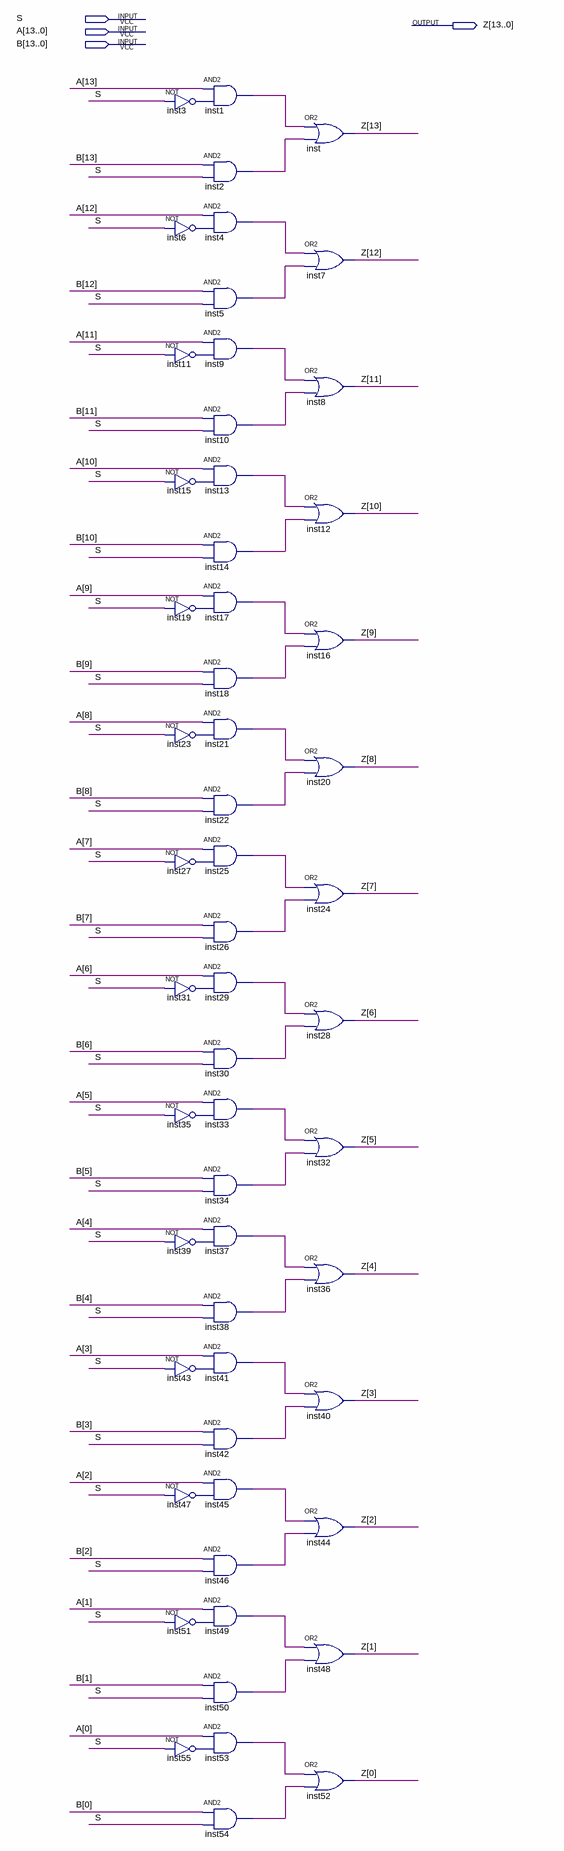
[diagram p0: schematic sheet]
// Quartus schematic g48_busmux.bdf as structural Verilog: 56 symbols, 4 pins
module g48_busmux (
  input  S,
  input  [13:0] A,
  input  [13:0] B,
  output [13:0] Z
);

  wire inst1_out, inst2_out, inst3_out, inst4_out, inst5_out, inst6_out, inst9_out, inst10_out, inst11_out,
       inst13_out, inst14_out, inst15_out, inst17_out, inst18_out, inst19_out, inst21_out, inst22_out,
       inst23_out, inst25_out, inst26_out, inst27_out, inst29_out, inst30_out, inst31_out, inst33_out,
       inst34_out, inst35_out, inst37_out, inst38_out, inst39_out, inst41_out, inst42_out, inst43_out,
       inst45_out, inst46_out, inst47_out, inst49_out, inst50_out, inst51_out, inst53_out, inst54_out,
       inst55_out;

  not inst3 (inst3_out, S);
  not inst6 (inst6_out, S);
  not inst11 (inst11_out, S);
  not inst15 (inst15_out, S);
  not inst19 (inst19_out, S);
  not inst23 (inst23_out, S);
  not inst27 (inst27_out, S);
  not inst31 (inst31_out, S);
  not inst35 (inst35_out, S);
  not inst39 (inst39_out, S);
  not inst43 (inst43_out, S);
  not inst47 (inst47_out, S);
  not inst51 (inst51_out, S);
  not inst55 (inst55_out, S);
  and inst1 (inst1_out, A[13], inst3_out);
  and inst2 (inst2_out, B[13], S);
  and inst4 (inst4_out, A[12], inst6_out);
  and inst5 (inst5_out, B[12], S);
  and inst9 (inst9_out, A[11], inst11_out);
  and inst10 (inst10_out, B[11], S);
  and inst13 (inst13_out, A[10], inst15_out);
  and inst14 (inst14_out, B[10], S);
  and inst17 (inst17_out, A[9], inst19_out);
  and inst18 (inst18_out, B[9], S);
  and inst21 (inst21_out, A[8], inst23_out);
  and inst22 (inst22_out, B[8], S);
  and inst25 (inst25_out, A[7], inst27_out);
  and inst26 (inst26_out, B[7], S);
  and inst29 (inst29_out, A[6], inst31_out);
  and inst30 (inst30_out, B[6], S);
  and inst33 (inst33_out, A[5], inst35_out);
  and inst34 (inst34_out, B[5], S);
  and inst37 (inst37_out, A[4], inst39_out);
  and inst38 (inst38_out, B[4], S);
  and inst41 (inst41_out, A[3], inst43_out);
  and inst42 (inst42_out, B[3], S);
  and inst45 (inst45_out, A[2], inst47_out);
  and inst46 (inst46_out, B[2], S);
  and inst49 (inst49_out, A[1], inst51_out);
  and inst50 (inst50_out, B[1], S);
  and inst53 (inst53_out, A[0], inst55_out);
  and inst54 (inst54_out, B[0], S);
  or inst (Z[13], inst1_out, inst2_out);
  or inst7 (Z[12], inst4_out, inst5_out);
  or inst8 (Z[11], inst9_out, inst10_out);
  or inst12 (Z[10], inst13_out, inst14_out);
  or inst16 (Z[9], inst17_out, inst18_out);
  or inst20 (Z[8], inst21_out, inst22_out);
  or inst24 (Z[7], inst25_out, inst26_out);
  or inst28 (Z[6], inst29_out, inst30_out);
  or inst32 (Z[5], inst33_out, inst34_out);
  or inst36 (Z[4], inst37_out, inst38_out);
  or inst40 (Z[3], inst41_out, inst42_out);
  or inst44 (Z[2], inst45_out, inst46_out);
  or inst48 (Z[1], inst49_out, inst50_out);
  or inst52 (Z[0], inst53_out, inst54_out);
endmodule
